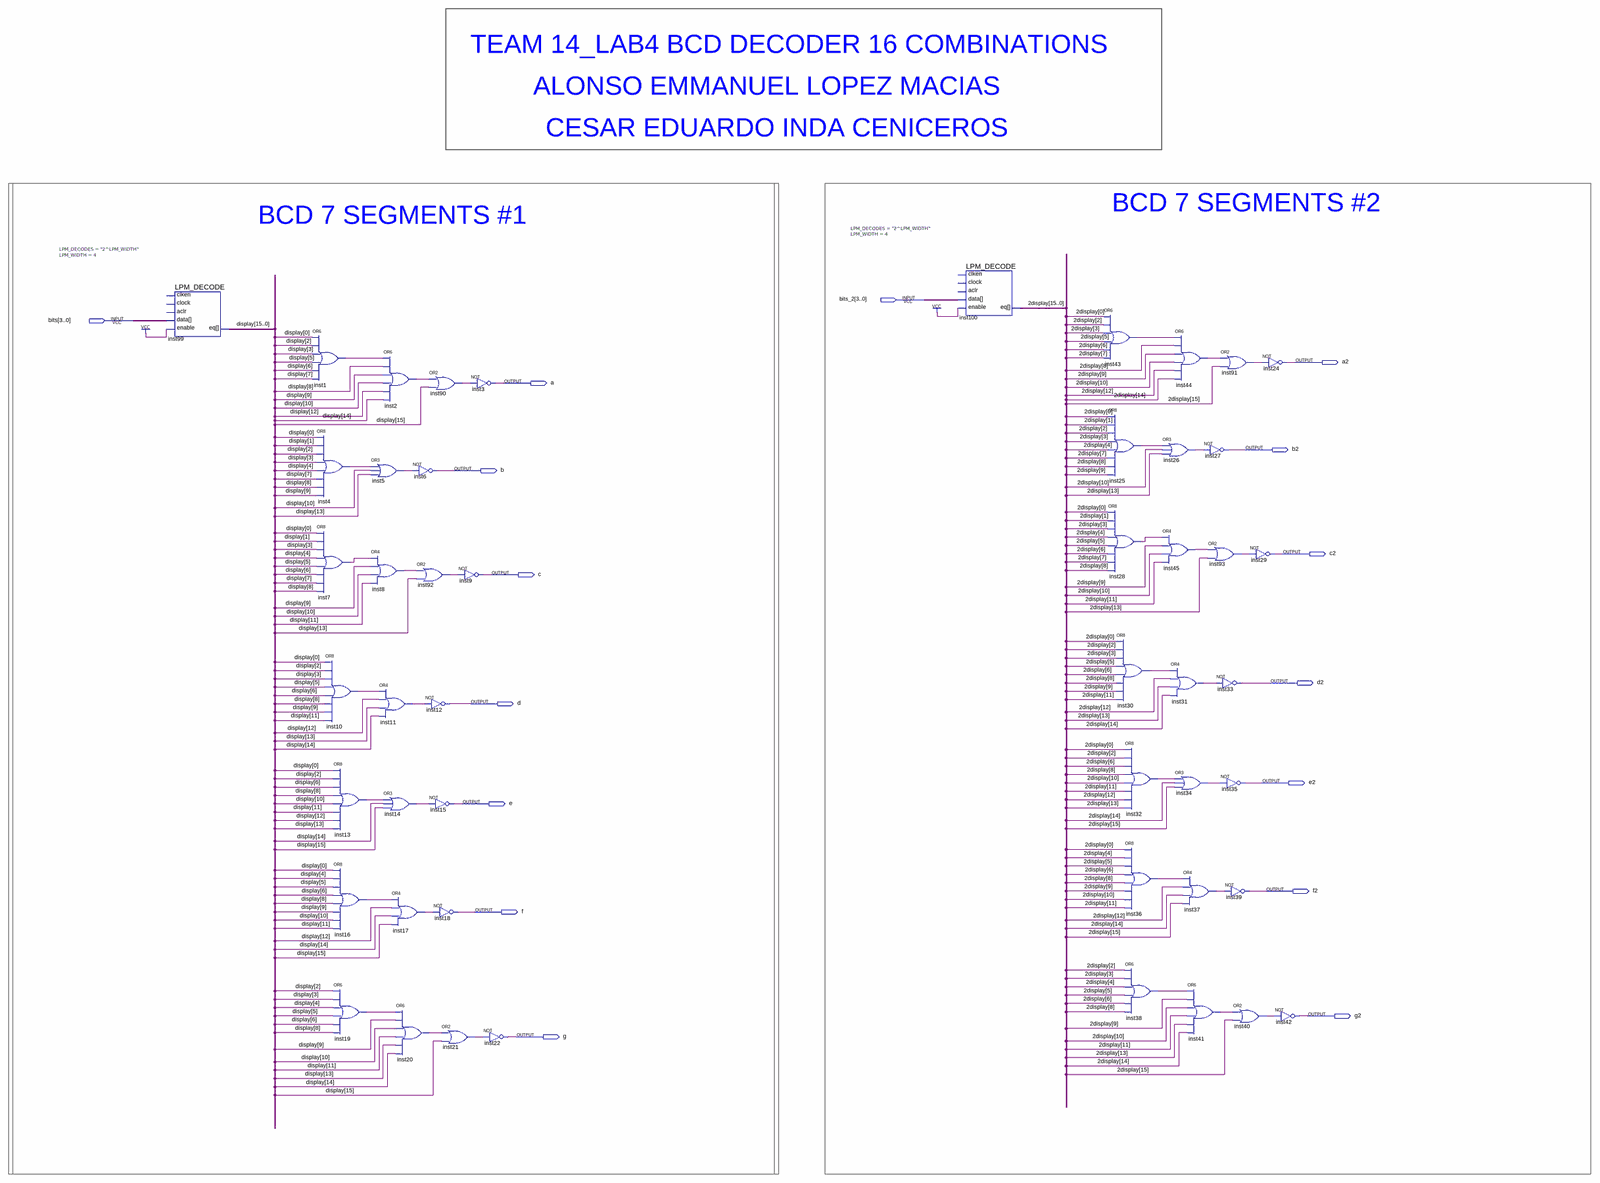
[diagram p0: schematic sheet, whole]
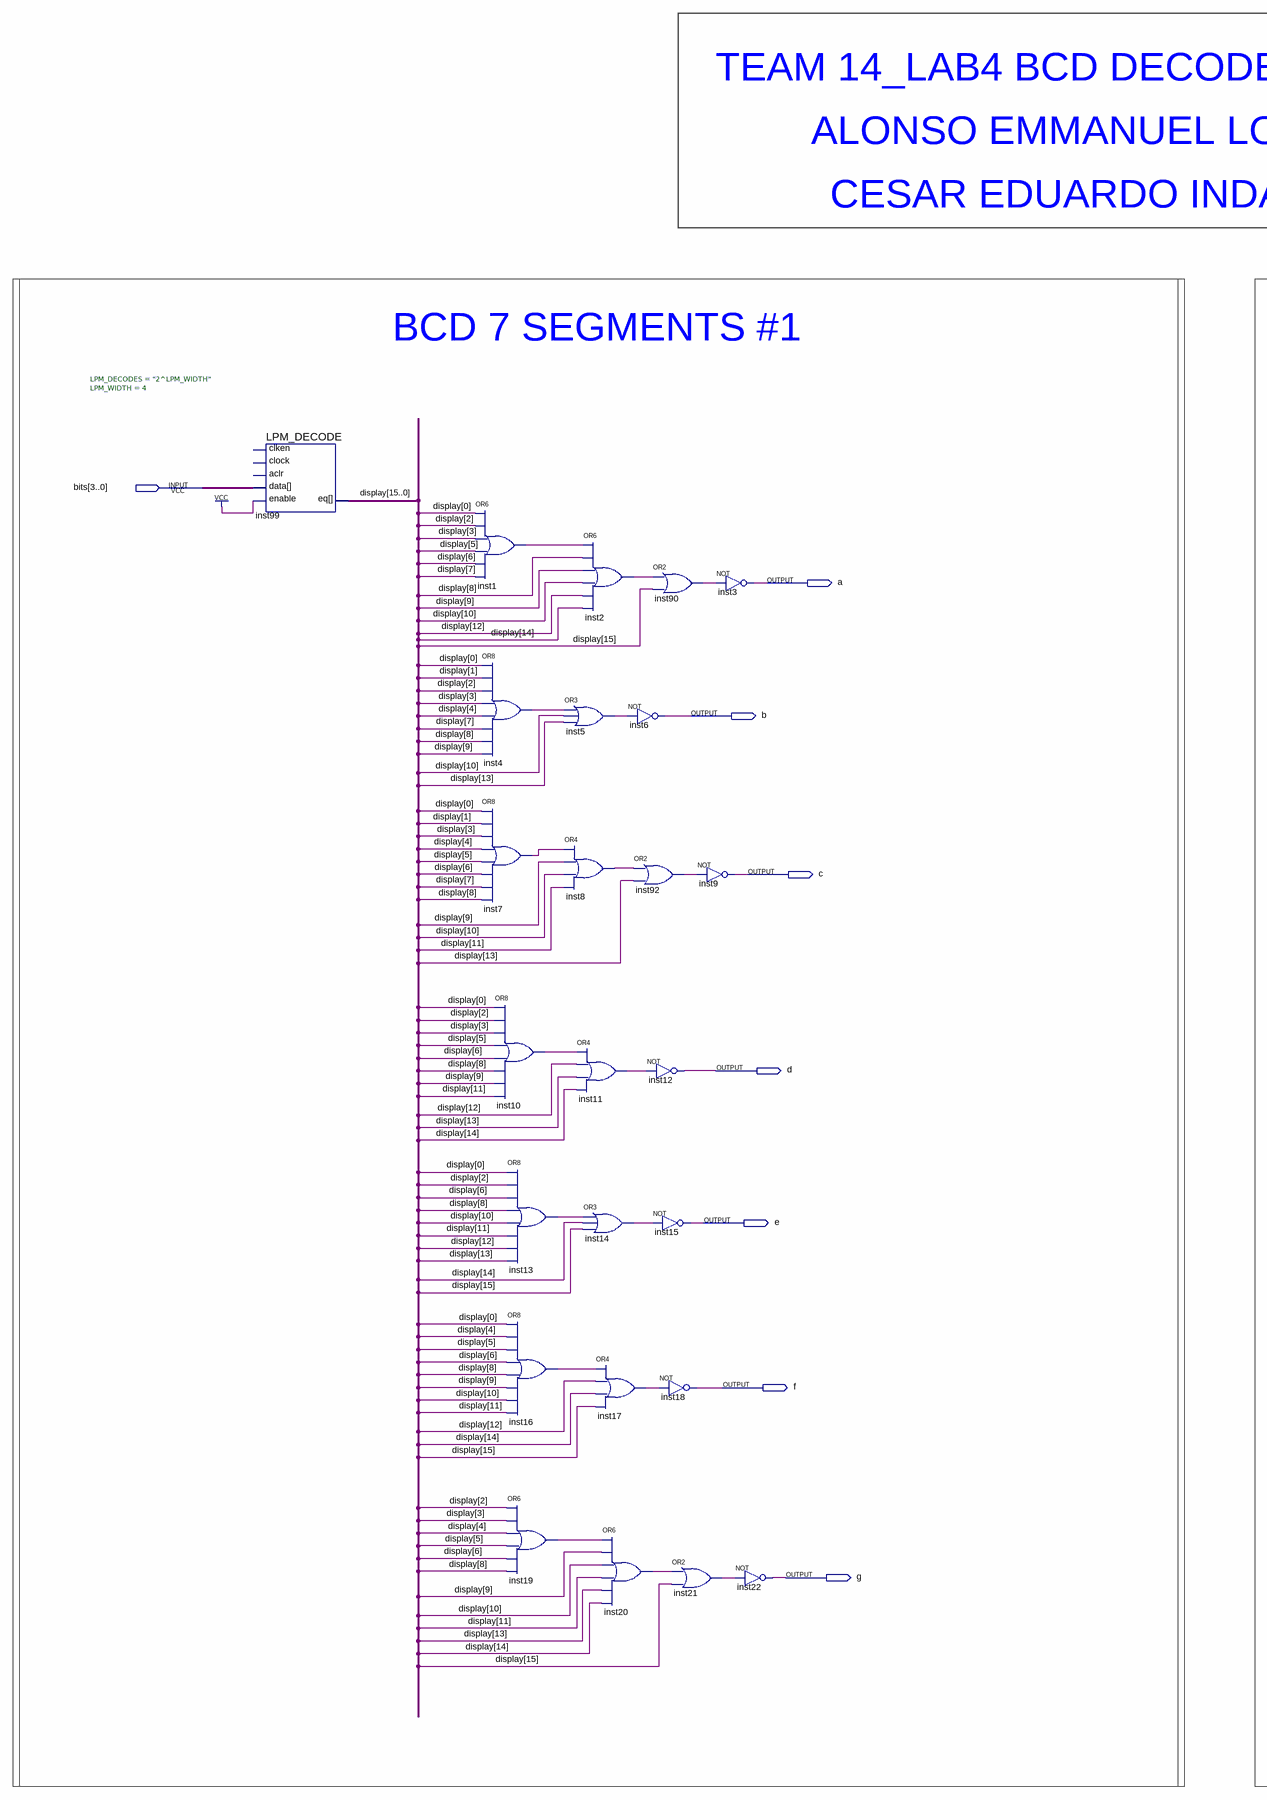
[diagram p1: schematic sheet, left part]
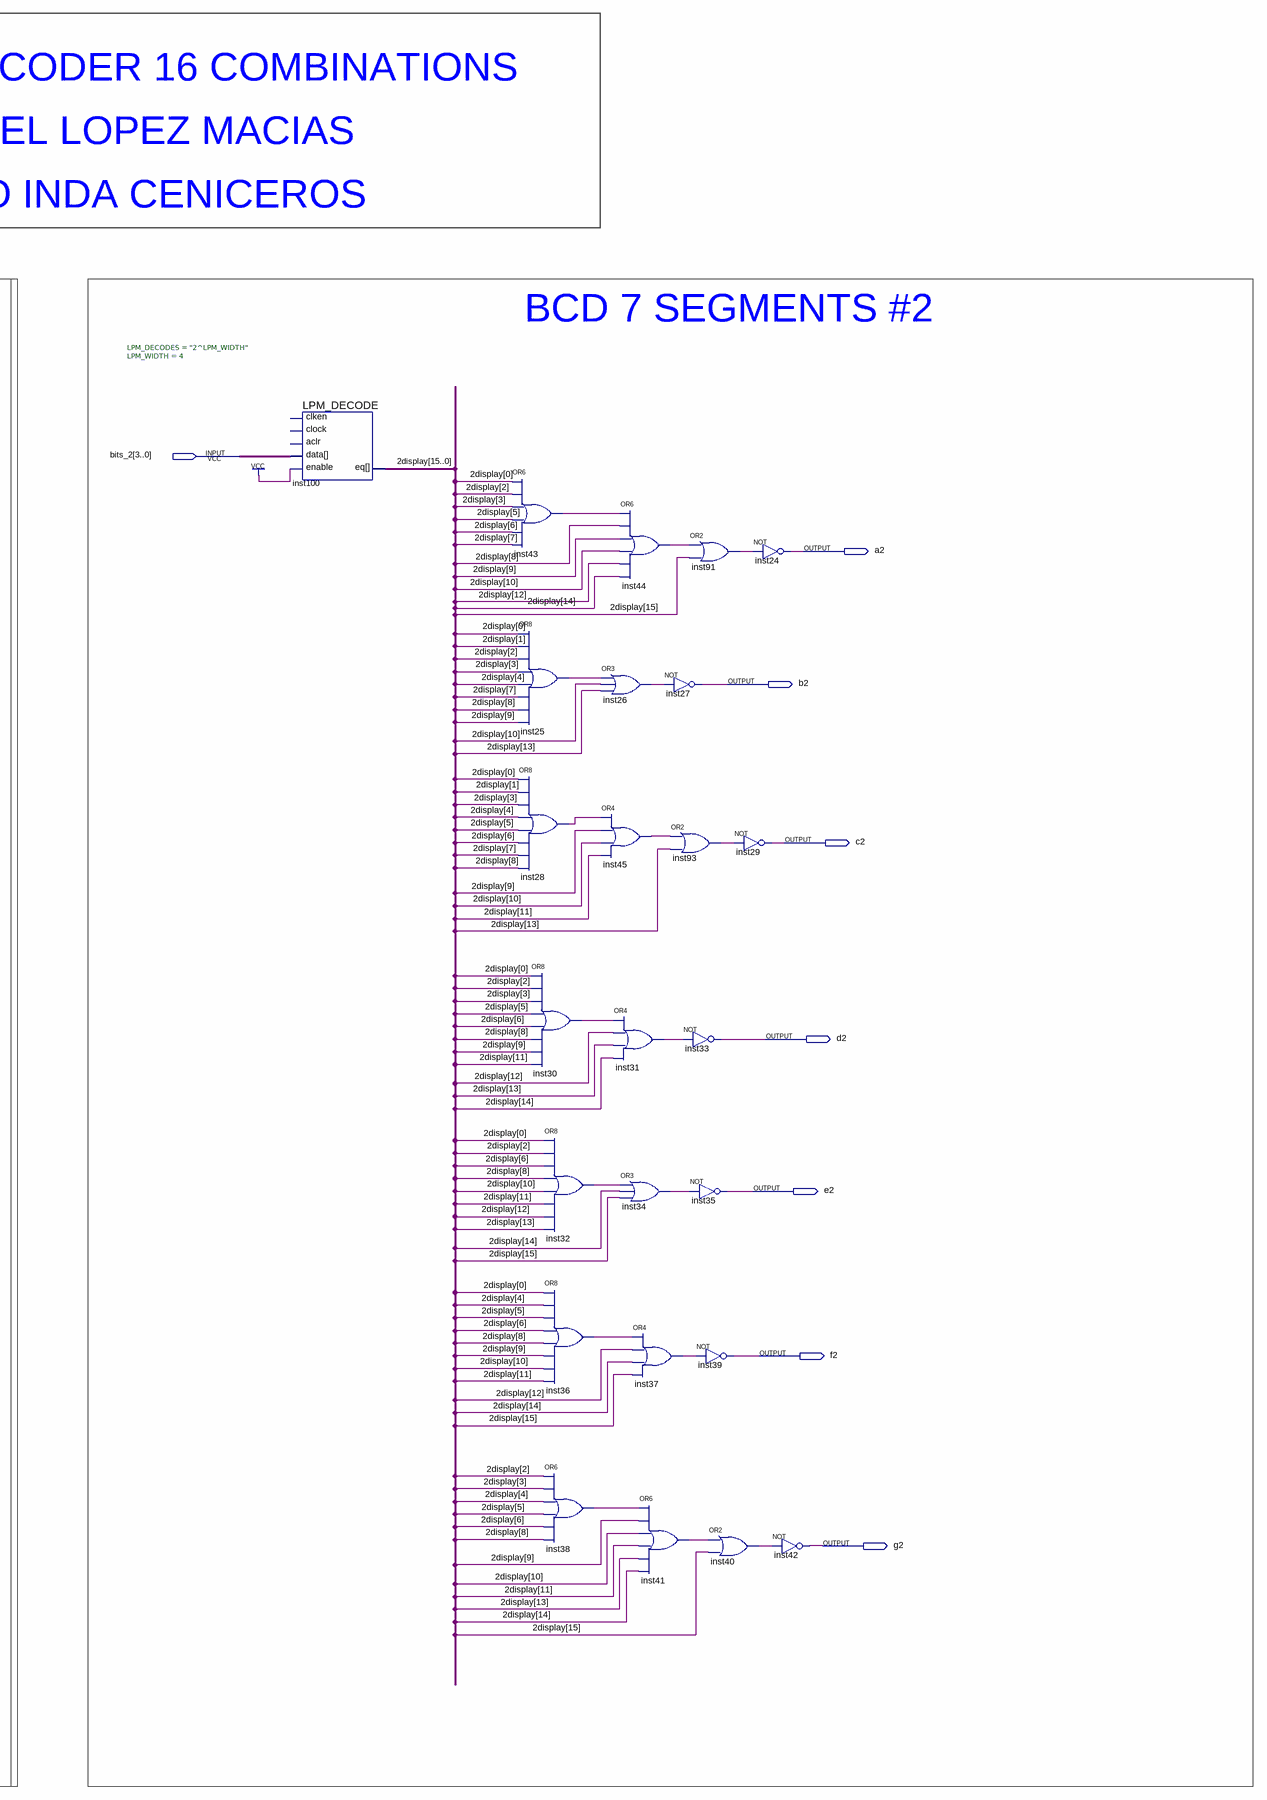
[diagram p2: schematic sheet, right part]
// Quartus schematic bcd_decoder.bdf as structural Verilog: 50 symbols, 16 pins
module bcd_decoder (
  input  [3:0] bits_2,
  input  [3:0] bits,
  output a2,
  output a,
  output b2,
  output b,
  output c2,
  output c,
  output d2,
  output d,
  output e2,
  output e,
  output f2,
  output f,
  output g2,
  output g
);

  wire inst1_out, inst2_out, inst4_out, inst5_out, inst7_out, inst8_out, inst10_out, inst11_out, inst13_out,
       inst14_out, inst16_out, inst17_out, inst19_out, inst20_out, inst21_out, inst25_out, inst26_out,
       inst28_out, inst30_out, inst31_out, inst32_out, inst34_out, inst36_out, inst37_out, inst38_out,
       inst40_out, inst41_out, inst43_out, inst44_out, inst45_out, inst90_out, inst91_out, inst92_out,
       inst93_out;
  wire [15:0] \2display , display;

  LPM_DECODE #(.LPM_DECODES("2^LPM_WIDTH"), .LPM_WIDTH(4)) inst99 (
    .data(bits), .enable(1'b1), .eq(display));  // open: aclr, clken, clock
  or inst1 (inst1_out, display[0], display[2], display[3], display[5], display[6], display[7]);
  or inst4 (inst4_out, display[0], display[1], display[2], display[3], display[4], display[7], display[8], display[9]);
  or inst7 (inst7_out, display[0], display[1], display[3], display[4], display[5], display[6], display[7], display[8]);
  or inst10 (inst10_out, display[0], display[2], display[3], display[5], display[6], display[8], display[9], display[11]);
  or inst13 (inst13_out, display[0], display[2], display[6], display[8], display[10], display[11], display[12], display[13]);
  or inst16 (inst16_out, display[0], display[4], display[5], display[6], display[8], display[9], display[10], display[11]);
  or inst19 (inst19_out, display[2], display[3], display[4], display[5], display[6], display[8]);
  or inst2 (inst2_out, inst1_out, display[8], display[9], display[10], display[12], display[14]);
  or inst5 (inst5_out, inst4_out, display[10], display[13]);
  or inst8 (inst8_out, inst7_out, display[9], display[10], display[11]);
  or inst11 (inst11_out, inst10_out, display[12], display[13], display[14]);
  or inst14 (inst14_out, inst13_out, display[14], display[15]);
  or inst17 (inst17_out, inst16_out, display[12], display[14], display[15]);
  or inst20 (inst20_out, inst19_out, display[9], display[10], display[11], display[13], display[14]);
  or inst90 (inst90_out, inst2_out, display[15]);
  not inst6 (b, inst5_out);
  or inst92 (inst92_out, inst8_out, display[13]);
  not inst12 (d, inst11_out);
  not inst15 (e, inst14_out);
  not inst9 (c, inst92_out);
  not inst18 (f, inst17_out);
  or inst21 (inst21_out, inst20_out, display[15]);
  not inst3 (a, inst90_out);
  not inst22 (g, inst21_out);
  LPM_DECODE #(.LPM_DECODES("2^LPM_WIDTH"), .LPM_WIDTH(4)) inst100 (
    .data(bits_2), .enable(1'b1), .eq(\2display ));  // open: aclr, clken, clock
  or inst43 (inst43_out, \2display [0], \2display [2], \2display [3], \2display [5], \2display [6], \2display [7]);
  or inst25 (inst25_out, \2display [0], \2display [1], \2display [2], \2display [3], \2display [4], \2display [7], \2display [8], \2display [9]);
  or inst28 (inst28_out, \2display [0], \2display [1], \2display [3], \2display [4], \2display [5], \2display [6], \2display [7], \2display [8]);
  or inst30 (inst30_out, \2display [0], \2display [2], \2display [3], \2display [5], \2display [6], \2display [8], \2display [9], \2display [11]);
  or inst32 (inst32_out, \2display [0], \2display [2], \2display [6], \2display [8], \2display [10], \2display [11], \2display [12], \2display [13]);
  or inst36 (inst36_out, \2display [0], \2display [4], \2display [5], \2display [6], \2display [8], \2display [9], \2display [10], \2display [11]);
  or inst38 (inst38_out, \2display [2], \2display [3], \2display [4], \2display [5], \2display [6], \2display [8]);
  or inst26 (inst26_out, inst25_out, \2display [10], \2display [13]);
  or inst45 (inst45_out, inst28_out, \2display [9], \2display [10], \2display [11]);
  or inst44 (inst44_out, inst43_out, \2display [8], \2display [9], \2display [10], \2display [12], \2display [14]);
  or inst31 (inst31_out, inst30_out, \2display [12], \2display [13], \2display [14]);
  or inst34 (inst34_out, inst32_out, \2display [14], \2display [15]);
  or inst37 (inst37_out, inst36_out, \2display [12], \2display [14], \2display [15]);
  or inst41 (inst41_out, inst38_out, \2display [9], \2display [10], \2display [11], \2display [13], \2display [14]);
  or inst91 (inst91_out, inst44_out, \2display [15]);
  not inst27 (b2, inst26_out);
  or inst93 (inst93_out, inst45_out, \2display [13]);
  not inst33 (d2, inst31_out);
  not inst35 (e2, inst34_out);
  not inst39 (f2, inst37_out);
  not inst24 (a2, inst91_out);
  not inst29 (c2, inst93_out);
  or inst40 (inst40_out, inst41_out, \2display [15]);
  not inst42 (g2, inst40_out);

  // Notes on the sheet:
  //   TEAM 14_LAB4 BCD DECODER 16 COMBINATIONS
  //   ALONSO EMMANUEL LOPEZ MACIAS
  //   CESAR EDUARDO INDA CENICEROS
  //   BCD 7 SEGMENTS #2
  //   BCD 7 SEGMENTS #1
endmodule
